# EAGLE schematic Encoders (EAGLE 7.4.0)
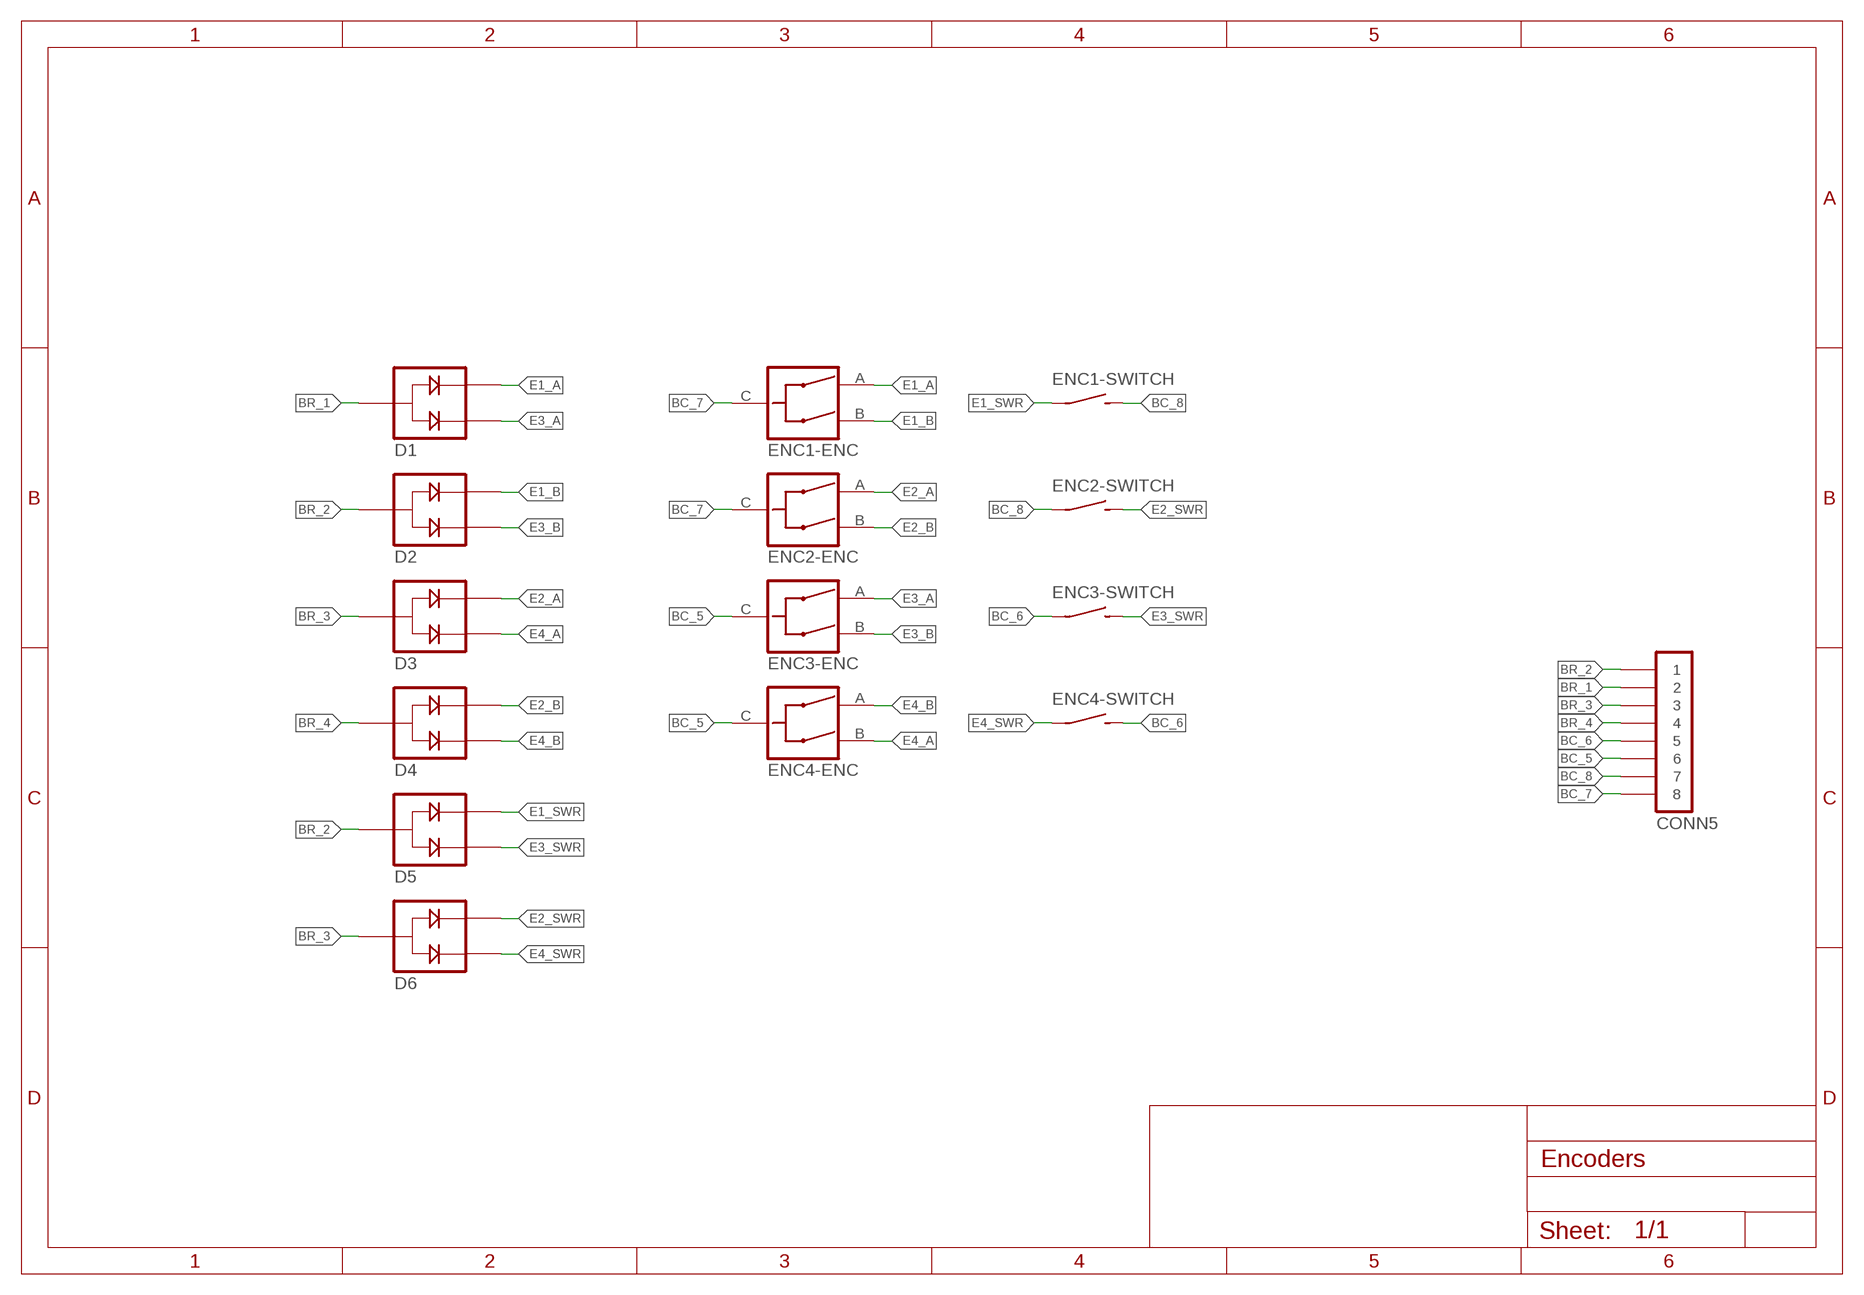
[diagram p0: schematic, sheet 1]

## Parts
CONN5  PINHD-1X08-FFC-1MM  [MOLEX-52793-0870]
D1  BAW56  [SOT23]
D2  BAW56  [SOT23]
D3  BAW56  [SOT23]
D4  BAW56  [SOT23]
D5  BAW56  [SOT23]
D6  BAW56  [SOT23]
ENC1  BOURNS-PEC12R-4XXXF-SXXXX  [PEC12R-42XXF-S0024]
ENC2  BOURNS-PEC12R-4XXXF-SXXXX  [PEC12R-42XXF-S0024]
ENC3  BOURNS-PEC12R-4XXXF-SXXXX  [PEC12R-42XXF-S0024]
ENC4  BOURNS-PEC12R-4XXXF-SXXXX  [PEC12R-42XXF-S0024]

## Nets
BC_5: CONN5.6 ENC3.C(-ENC:C) ENC4.C(-ENC:C)
BC_6: CONN5.5 ENC3.SW1 ENC4.SW2
BC_7: CONN5.8 ENC1.C(-ENC:C) ENC2.C(-ENC:C)
BC_8: CONN5.7 ENC1.SW2 ENC2.SW1
BR_1: CONN5.2 D1.3
BR_2: CONN5.1 D2.3 D5.3
BR_3: CONN5.3 D3.3 D6.3
BR_4: CONN5.4 D4.3
E1_A: D1.2 ENC1.A(-ENC:A)
E1_B: D2.2 ENC1.B(-ENC:B)
E1_SWR: D5.2 ENC1.SW1
E2_A: D3.2 ENC2.A(-ENC:A)
E2_B: D4.2 ENC2.B(-ENC:B)
E2_SWR: D6.2 ENC2.SW2
E3_A: D1.1 ENC3.A(-ENC:A)
E3_B: D2.1 ENC3.B(-ENC:B)
E3_SWR: D5.1 ENC3.SW2
E4_A: D3.1 ENC4.B(-ENC:B)
E4_B: D4.1 ENC4.A(-ENC:A)
E4_SWR: D6.1 ENC4.SW1

## Library data of the parts
CONN5 = igor_lbr:PINHD-1X08: Pin Header with 2.54mm spacing, 1 row, 8 pins
D1-D6 = igor_lbr:BAW56: Small Signal Diode; MANUFACTURER: Multicomp; MPN: BAW56-7-F
ENC1-ENC4 = igor_lbr:BOURNS-PEC12R-4XXXF-SXXXX

## Net classes
0 default: width 0.203 mm